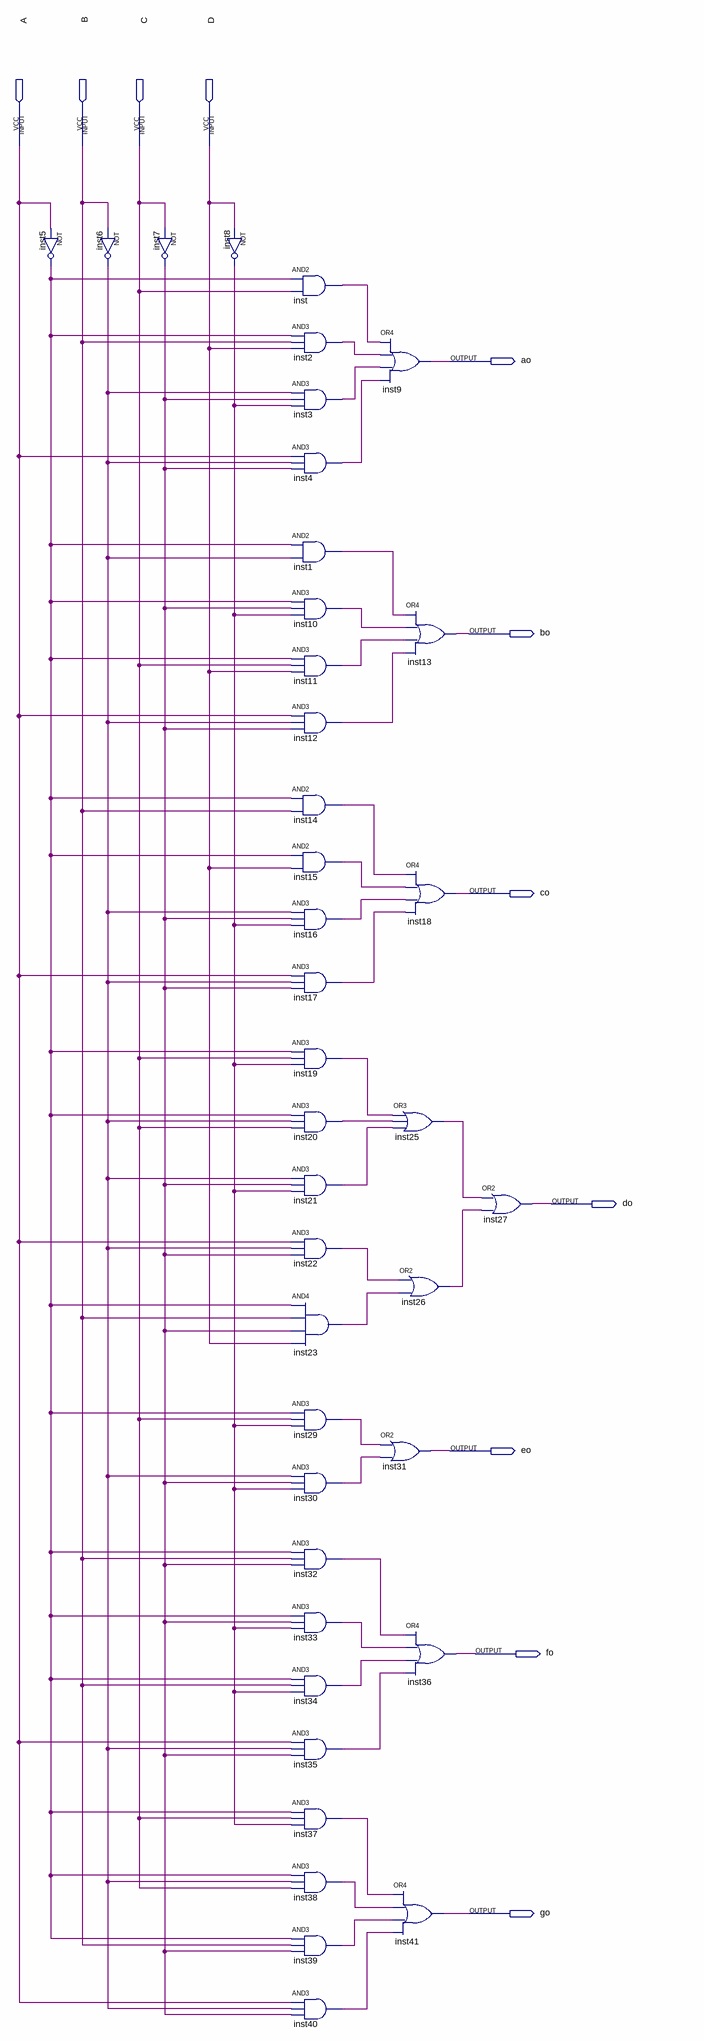
[diagram p0: schematic sheet]
// Quartus schematic Altera.bdf as structural Verilog: 40 symbols, 11 pins
module Altera (
  input  A,
  input  B,
  input  C,
  input  D,
  output ao,
  output bo,
  output co,
  output \do ,
  output eo,
  output fo,
  output go
);

  wire inst1_out, inst2_out, inst3_out, inst4_out, inst5_out, inst6_out, inst7_out, inst8_out, inst10_out,
       inst11_out, inst12_out, inst14_out, inst15_out, inst16_out, inst17_out, inst19_out, inst20_out,
       inst21_out, inst22_out, inst23_out, inst25_out, inst26_out, inst29_out, inst30_out, inst32_out,
       inst33_out, inst34_out, inst35_out, inst37_out, inst38_out, inst39_out, inst40_out, inst_out;

  not inst5 (inst5_out, A);
  not inst6 (inst6_out, B);
  not inst7 (inst7_out, C);
  not inst8 (inst8_out, D);
  and inst (inst_out, inst5_out, C);
  and inst2 (inst2_out, inst5_out, B, D);
  and inst3 (inst3_out, inst6_out, inst7_out, inst8_out);
  and inst4 (inst4_out, A, inst6_out, inst7_out);
  and inst1 (inst1_out, inst5_out, inst6_out);
  and inst10 (inst10_out, inst5_out, inst7_out, inst8_out);
  and inst11 (inst11_out, inst5_out, C, D);
  and inst12 (inst12_out, A, inst6_out, inst7_out);
  and inst14 (inst14_out, inst5_out, B);
  and inst15 (inst15_out, inst5_out, D);
  and inst16 (inst16_out, inst6_out, inst7_out, inst8_out);
  and inst17 (inst17_out, A, inst6_out, inst7_out);
  and inst19 (inst19_out, inst5_out, C, inst8_out);
  and inst20 (inst20_out, inst5_out, inst6_out, C);
  and inst21 (inst21_out, inst6_out, inst7_out, inst8_out);
  and inst22 (inst22_out, A, inst6_out, inst7_out);
  and inst23 (inst23_out, inst5_out, B, inst7_out, D);
  and inst29 (inst29_out, inst5_out, C, inst8_out);
  and inst30 (inst30_out, inst6_out, inst7_out, inst8_out);
  and inst32 (inst32_out, inst5_out, B, inst7_out);
  and inst33 (inst33_out, inst5_out, inst7_out, inst8_out);
  and inst34 (inst34_out, inst5_out, B, inst8_out);
  and inst35 (inst35_out, A, inst6_out, inst7_out);
  and inst37 (inst37_out, inst5_out, C, inst8_out);
  and inst38 (inst38_out, inst5_out, inst6_out, C);
  and inst39 (inst39_out, inst5_out, B, inst7_out);
  and inst40 (inst40_out, A, inst6_out, inst7_out);
  or inst9 (ao, inst_out, inst2_out, inst3_out, inst4_out);
  or inst13 (bo, inst1_out, inst10_out, inst11_out, inst12_out);
  or inst18 (co, inst14_out, inst15_out, inst16_out, inst17_out);
  or inst25 (inst25_out, inst19_out, inst20_out, inst21_out);
  or inst26 (inst26_out, inst22_out, inst23_out);
  or inst31 (eo, inst29_out, inst30_out);
  or inst36 (fo, inst32_out, inst33_out, inst34_out, inst35_out);
  or inst41 (go, inst37_out, inst38_out, inst39_out, inst40_out);
  or inst27 (\do , inst25_out, inst26_out);
endmodule
